# Altium schematic sheet MIC4690YM-TR.SchDoc
size A; SheetNumber: 5; SheetTotal: 7
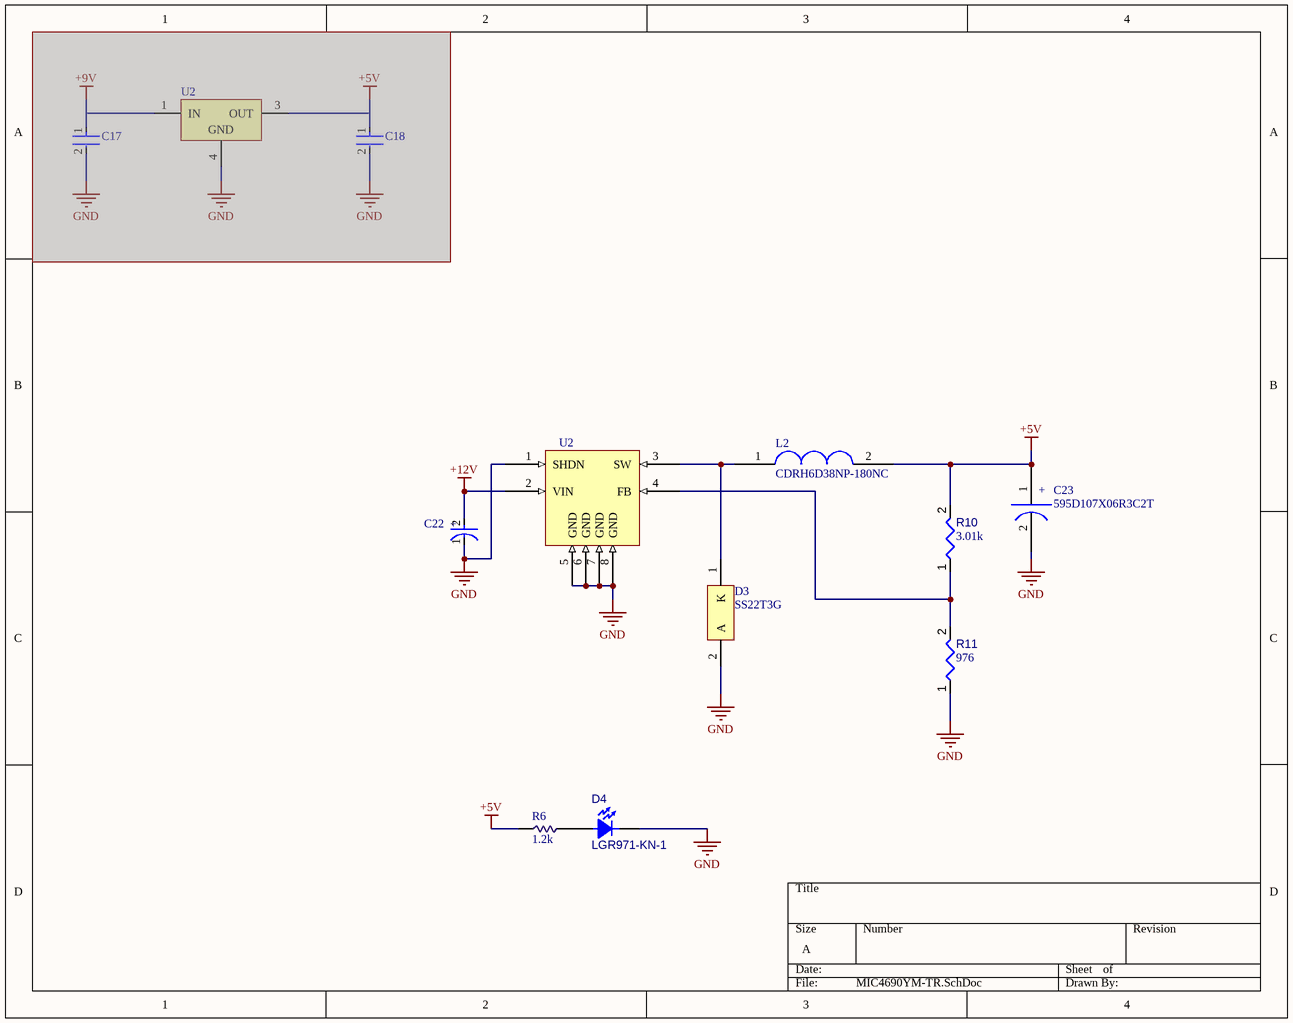
[diagram p0: MIC4690YM-TR.SchDoc]

## Parts
(Parts that share a designator on the sheet are numbered #1, #2 ... from top to bottom, then left to right.)
C17  C1206C334K1RACTU  [FP-C1206C-EB-MFG]  (value not drawn)  (masked out: inside a compile mask, not in the netlist)
C18  C1206C104K1RACTU  [FP-C1206C-EB-MFG]  (value not drawn)  (masked out: inside a compile mask, not in the netlist)
C22  47uF  [FP-T528Z477M2R5ATE008-MFG]  (value not drawn)
C23  595D107X06R3C2T  [595D107X06R3C2T]
D3  SS22T3G  [ONSC-SMB-2-403A-03_V]
D4  LGR971-KN-1  [FOOTPRINT-OSRAM-CHIPLED-0805-1A2K]
L2  CDRH6D38NP-180NC  [CDRH6D38NP-180NC]
R6  value 1.2k  [FOOTPRINT-0805-GEN]  (hidden comment: RMCF0805FT1K20)
R10  value 3.01k  [RESC3216X60X45ML15T20]  (hidden comment: Resistor 3.01k +/-1% 1206 250 mW)
R11  value 976  [RESC3216X60X45ML15T20]  (hidden comment: Resistor 976 +/-1% 1206 250 mW)
U2#1  L7805CD2T-TR  [TO-263_M]  (value not drawn)  (masked out: inside a compile mask, not in the netlist)
U2#2  MIC4690YM-TR  [TPS5402]  (value not drawn)

## Nets
+5V: C23.1 L2.2 R6.2 R10.2
+12V: C22.2(A) U2#2.2(VIN)
GND: C22.1(C) C23.2 D3.2(A) D4.2(K) R11.1 U2#2.1(SHDN) U2#2.5(GND) U2#2.6(GND) U2#2.7(GND) U2#2.8(GND)
NetD3_1: D3.1(K) L2.1 U2#2.3(SW)
NetD4_1: D4.1(A) R6.1
NetR10_1: R10.1 R11.2 U2#2.4(FB)

## Notes on the sheet
- (in symbol 595D107X06R3C2T) +
- (in symbol CMP-03017-000005-1) +

## Library data of the parts
C17 = CMP-1037-04498-2: CAP CER 0.33UF 100V X7R 1206 / C1206C334K1RACTU; Manufacturer: KEMET; Material: Ceramic; Value: 0.33 μF; Automotive Grade: Grade 0; Temperature Coefficient: 15%; Tolerance: 0.1; Voltage Rating: 100 V; Height: 0.88mm; Device Class L1: Passive Components; Device Class L2: Capacitors; Package: C1206C-EB; Lead Free: Yes; Mouser Description: Cap Ceramic 0.33uF 100V X7R 10% SMD 1206 125°C Plastic T/R; ComponentLink2URL: https://content.kemet.com/datasheets/KEM_C1007_X8R_ULTRA_150C_SMD.pdf; Digikey Description: CAP CER 0.33UF 100V X7R 1206; Category: Cap; Automotive: Yes; Temperature Range Low: -55°C; Ipc Land Pattern Name: CAPC320160X78; Manufacturer Part Number: C1206C334K1RACTU; Temperature: -55°C to +150°C; Temperature Range High: +150°C; RoHS: TRUE; Device Class L3: Ceramic Capacitors; Octopart: https://octopart.com/c1206c334k1ractu-kemet-9144123; Capacitance: 0.33 μF; Temperature Characteristic: X7R; ComponentLink2Description: Datasheet
C18 = CMP-03020-000153-1: CAP CER 0.1UF 100V X7R 1206 / C1206C104K1RACTU; Manufacturer: KEMET; Value: 0.10 μF; Tolerance: 0.1; Material: Ceramic; Temperature Coefficient: 15%; Automotive Grade: Grade 0; Voltage Rating: 100 V; Automotive: Yes; Ipc Land Pattern Name: CAPC320160X78; Device Class L1: Passive Components; ComponentLink2Description: Datasheet; Temperature Range Low: -55°C; Category: Cap; Octopart: https://octopart.com/c1206c104k1ractu-kemet-89521; Height: 0.88mm; Lead Free: Yes; Digikey Description: CAP CER 0.1UF 100V X7R 1206; Mouser Description: CAP CER 0.1UF 100V X7R 1206; Device Class L3: Ceramic Capacitors; Device Class L2: Capacitors; ComponentLink2URL: https://content.kemet.com/datasheets/KEM_C1007_X8R_ULTRA_150C_SMD.pdf; Temperature Range High: +150°C; Temperature Characteristic: X7R; Manufacturer Part Number: C1206C104K1RACTU; RoHS: TRUE; Capacitance: 0.10 μF; Package: C1206C-EB; Temperature: -55°C to +150°C
C22 = CMP-03017-000005-1: CAP TANT 47UF 20% 20V 2917 / 595D476X0020D2T; Voltage Rating (DC): 2.5V; Ripple Current: 6.4A; Dissipation Factor: 10%; ESR (Equivalent Series Resistance): 8mR; Capacitance: 470uF; Leakage Current: 118uA; Polarity: Polar; Max Operating Temperature: 105°C; RoHS Compliant: Yes; Mount: Surface Mount; Depth: 4.3mm; Voltage Rating: 2.5V; Width: 0.169inch; Package Quantity: 1; Height: 1.7mm; Packaging: Tape and Reel; Features: General Purpose; Termination: SMD/SMT; Case/Package: 2917; Min Operating Temperature: -55°C; Height - Seated (Max): 0.067inch; Case Code (Imperial): 2917; Case Code (Metric): 7343; Length: 7.3mm; Construction: Flat; Series: KO-CAP T528; Tolerance: 20%; REACH SVHC: No SVHC
C23 = 595D107X06R3C2T: 595D107X06R3C2T / 100uF, 6.3V
D3 = CMP-1055-00373-1: Schottky Power Rectifier, 2-Pin SMB, Pb-Free, Tape and Reel; Manufacturer: On Semiconductor; IFSM Max (A): 75; Configuration: Single; DatasheetVersion: Rev. 4; PackageVersion: Rev. J, 07/2012; ComponentLink3Description: Package Specification; ComponentLink2Description: Datasheet; PackageDescription: 2-Pin Small Molded Package, J-Bend Lead, Body 4.33 x 3.625 mm; Mounting Technology: Surface Mount; PartNumber: SS22T3G; ComponentLink3URL: http://www.onsemi.com/pub_link/Collateral/403A-03.PDF; Packing: Tape and Reel; ComponentLink1URL: http://www.onsemi.com/; ComponentLink2URL: http://www.onsemi.cn/pub_link/Collateral/SS24-D.PDF; PackageReference: SMB-2-403A-03; RoHS: TRUE; ComponentLink1Description: Manufacturer URL
D4 = CMP-017-000003-2: LED Uni-Color Green 572nm 2-Pin Chip 0805(2012Metric) T/R; Part Number: 475-1410-1-ND; Current - Maximum: 25mA; Current - Test: 20mA; Forward Voltage: 2.2V; Design Item ID: LED-OSRAM-LG-R971-KN-1; Source: Discrete.SchLib
R6 = CMP-009-00185-2: Res Thick Film 0805 1.2K Ohm 1% 0.125W ±100ppm/°C Molded SMD Paper T/R; Design Item ID: Resistor-Generic-0805-2012; Source: Generic.SchLib; Type: Resistor
R10 = CMP-009-00016-4: Chip Resistor, 3.01KOhm, +/- 1%, 0.25 W, -55 to 155 degC, 1206 (3216 Metric); Power: 250mW; Voltage Rating: 200V; Max Operating Temperature: 155°C; Mounting Technology: SM; Case/Package: 1206; Pins: 2; Min Operating Temperature: -55°C; RoHS Compliant: True; Tolerance: 1%
R11 = CMP-009-00016-4: Chip Resistor, 976Ohm, +/- 1%, 0.25 W, -55 to 155 degC, 1206 (3216 Metric); Power: 250mW; Voltage Rating: 200V; Max Operating Temperature: 155°C; Mounting Technology: SM; Case/Package: 1206; Pins: 2; Min Operating Temperature: -55°C; RoHS Compliant: True; Tolerance: 1%
U2#1 = CMP-0244-00213-1: Positive Voltage Regulator, 3-Pin D2PAK, Tape and Reel / L7805CD2T-TR; PackageReference: TO-263; ComponentLink2URL: http://www.st.com/internet/com/TECHNICAL_RESOURCES/TECHNICAL_LITERATURE/DATASHEET/CD00000444.pdf; PackageDescription: 3-Pin Transistor Outline Package 2.54 mm Pitch, 15.4 mm Lead Span (D2PAK); DatasheetVersion: 16/11/2011; ComponentLink2Description: Datasheet; ComponentLink1Description: Manufacturer URL; PackageVersion: 2011; ComponentLink1URL: http://www.st.com